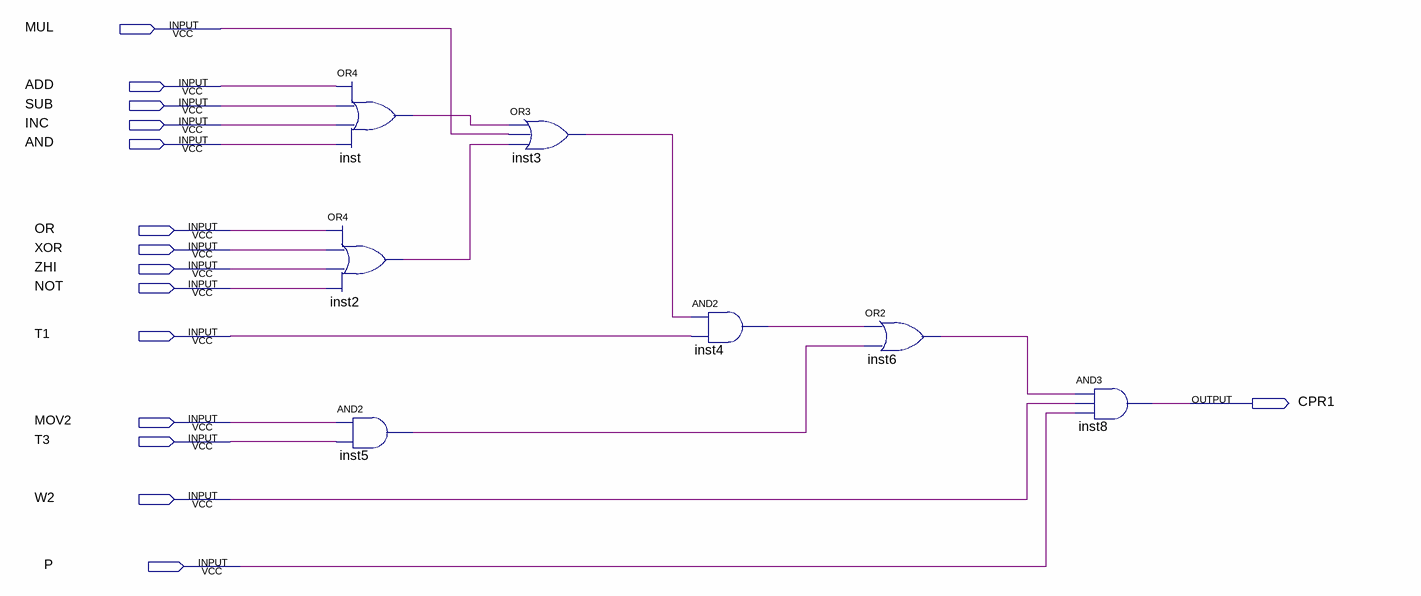
[diagram p0: schematic sheet]
// Quartus schematic CPR1.bdf as structural Verilog: 7 symbols, 15 pins
module CPR1 (
  input  MUL,
  input  ADD,
  input  SUB,
  input  INC,
  input  AND,
  input  OR,
  input  XOR,
  input  ZHI,
  input  NOT,
  input  T1,
  input  MOV2,
  input  T3,
  input  W2,
  input  P,
  output CPR1
);

  wire inst2_out, inst3_out, inst4_out, inst5_out, inst6_out, inst_out;

  or inst (inst_out, ADD, SUB, INC, AND);
  or inst2 (inst2_out, OR, XOR, ZHI, NOT);
  and inst5 (inst5_out, MOV2, T3);
  or inst3 (inst3_out, inst_out, MUL, inst2_out);
  and inst4 (inst4_out, inst3_out, T1);
  or inst6 (inst6_out, inst4_out, inst5_out);
  and inst8 (CPR1, inst6_out, W2, P);
endmodule
